# Altium schematic sheet RF_Ticketing_Slave.SchDoc
size A4; Organization: ETML-ES; Address1: Avenue Recordon 1; Address2: 1004 Lausanne; Address3: Switzerland
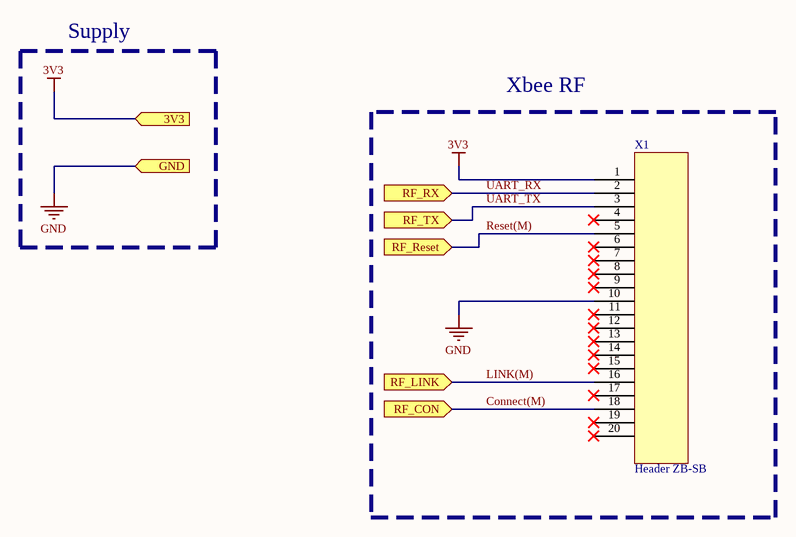
[diagram p0: RF_Ticketing_Slave.SchDoc]

## Parts
X1  Header ZB-SB  [ZB-SB]

## Blocks framed on the sheet
Xbee RF: X1

## Ports
3V3, GND, RF_CON, RF_LINK, RF_Reset, RF_RX, RF_TX

## Nets
3V3: X1.1 ; port 3V3
GND: X1.10 ; port GND
Connect(M): X1.18 ; port RF_CON
LINK(M): X1.16 ; port RF_LINK
Reset(M): X1.5 ; port RF_Reset
UART_RX: X1.2 ; port RF_RX
UART_TX: X1.3 ; port RF_TX

Not connected (* = marked no-connect by the designer): X1 4* 6* 7* 8* 9* 11* 12* 13* 14* 15* 17* 19* 20*

## Notes on the sheet
- Supply
- Fichier :
- Date :
- Heure :
- Projet :
- Auteur :
- Version :
- Chemin :

## Library data of the parts
X1 = HDR ZB-SB 2x10: Header 2x10; PackageCase: XBee; Value: 2x10